# Altium schematic sheet LiPo_4S_balancer.SchDoc
size A4
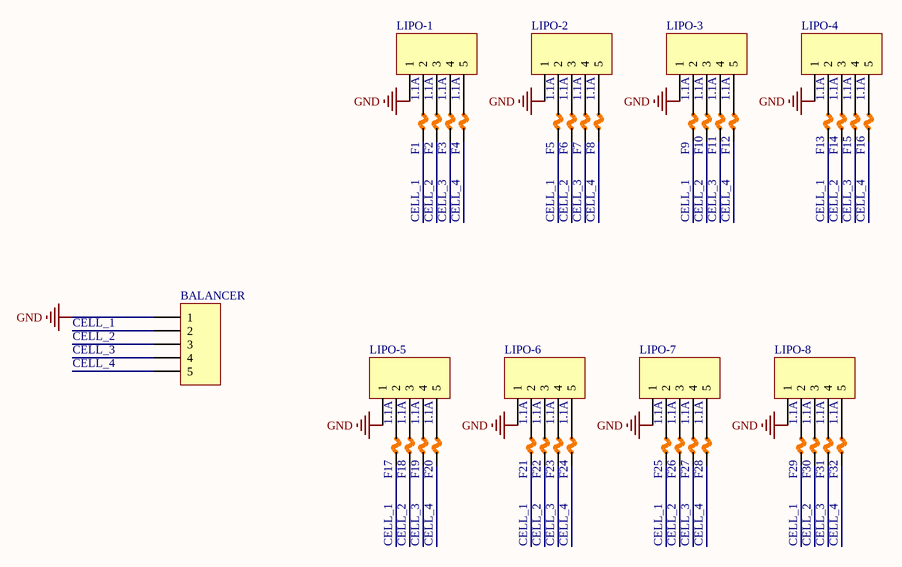
[diagram p0: LiPo_4S_balancer.SchDoc]

## Parts
BALANCER  Header 1X5  [HEADER_2.54MM_F_1x5]  (value not drawn)
F1  1.1A  [TH multifuse 5mm]
F2  1.1A  [TH multifuse 5mm]
F3  1.1A  [TH multifuse 5mm]
F4  1.1A  [TH multifuse 5mm]
F5  1.1A  [TH multifuse 5mm]
F6  1.1A  [TH multifuse 5mm]
F7  1.1A  [TH multifuse 5mm]
F8  1.1A  [TH multifuse 5mm]
F9  1.1A  [TH multifuse 5mm]
F10  1.1A  [TH multifuse 5mm]
F11  1.1A  [TH multifuse 5mm]
F12  1.1A  [TH multifuse 5mm]
F13  1.1A  [TH multifuse 5mm]
F14  1.1A  [TH multifuse 5mm]
F15  1.1A  [TH multifuse 5mm]
F16  1.1A  [TH multifuse 5mm]
F17  1.1A  [TH multifuse 5mm]
F18  1.1A  [TH multifuse 5mm]
F19  1.1A  [TH multifuse 5mm]
F20  1.1A  [TH multifuse 5mm]
F21  1.1A  [TH multifuse 5mm]
F22  1.1A  [TH multifuse 5mm]
F23  1.1A  [TH multifuse 5mm]
F24  1.1A  [TH multifuse 5mm]
F25  1.1A  [TH multifuse 5mm]
F26  1.1A  [TH multifuse 5mm]
F27  1.1A  [TH multifuse 5mm]
F28  1.1A  [TH multifuse 5mm]
F29  1.1A  [TH multifuse 5mm]
F30  1.1A  [TH multifuse 5mm]
F31  1.1A  [TH multifuse 5mm]
F32  1.1A  [TH multifuse 5mm]
LIPO-1  Header 1X5  [HEADER_2.54MM_F_1x5]  (value not drawn)
LIPO-2  Header 1X5  [HEADER_2.54MM_F_1x5]  (value not drawn)
LIPO-3  Header 1X5  [HEADER_2.54MM_F_1x5]  (value not drawn)
LIPO-4  Header 1X5  [HEADER_2.54MM_F_1x5]  (value not drawn)
LIPO-5  Header 1X5  [HEADER_2.54MM_F_1x5]  (value not drawn)
LIPO-6  Header 1X5  [HEADER_2.54MM_F_1x5]  (value not drawn)
LIPO-7  Header 1X5  [HEADER_2.54MM_F_1x5]  (value not drawn)
LIPO-8  Header 1X5  [HEADER_2.54MM_F_1x5]  (value not drawn)

## Nets
GND: BALANCER.1 LIPO-1.1 LIPO-2.1 LIPO-3.1 LIPO-4.1 LIPO-5.1 LIPO-6.1 LIPO-7.1 LIPO-8.1
CELL_1: BALANCER.2 F1.1 F5.1 F9.1 F13.1 F17.1 F21.1 F25.1 F29.1
CELL_2: BALANCER.3 F2.1 F6.1 F10.1 F14.1 F18.1 F22.1 F26.1 F30.1
CELL_3: BALANCER.4 F3.1 F7.1 F11.1 F15.1 F19.1 F23.1 F27.1 F31.1
CELL_4: BALANCER.5 F4.1 F8.1 F12.1 F16.1 F20.1 F24.1 F28.1 F32.1
NetF1_2: F1.2 LIPO-1.2
NetF2_2: F2.2 LIPO-1.3
NetF3_2: F3.2 LIPO-1.4
NetF4_2: F4.2 LIPO-1.5
NetF5_2: F5.2 LIPO-2.2
NetF6_2: F6.2 LIPO-2.3
NetF7_2: F7.2 LIPO-2.4
NetF8_2: F8.2 LIPO-2.5
NetF9_2: F9.2 LIPO-3.2
NetF10_2: F10.2 LIPO-3.3
NetF11_2: F11.2 LIPO-3.4
NetF12_2: F12.2 LIPO-3.5
NetF13_2: F13.2 LIPO-4.2
NetF14_2: F14.2 LIPO-4.3
NetF15_2: F15.2 LIPO-4.4
NetF16_2: F16.2 LIPO-4.5
NetF17_2: F17.2 LIPO-5.2
NetF18_2: F18.2 LIPO-5.3
NetF19_2: F19.2 LIPO-5.4
NetF20_2: F20.2 LIPO-5.5
NetF21_2: F21.2 LIPO-6.2
NetF22_2: F22.2 LIPO-6.3
NetF23_2: F23.2 LIPO-6.4
NetF24_2: F24.2 LIPO-6.5
NetF25_2: F25.2 LIPO-7.2
NetF26_2: F26.2 LIPO-7.3
NetF27_2: F27.2 LIPO-7.4
NetF28_2: F28.2 LIPO-7.5
NetF29_2: F29.2 LIPO-8.2
NetF30_2: F30.2 LIPO-8.3
NetF31_2: F31.2 LIPO-8.4
NetF32_2: F32.2 LIPO-8.5

## Library data of the parts
BALANCER LIPO-1-LIPO-8 = Header 1X5: Header, 5-Pin; LatestRevisionDate: 17-Jul-2002; LatestRevisionNote: Re-released for DXP Platform.; Publisher: Altium Limited
F1-F32 = MULTIFUSE: Order Info: TODO; Part Number: TODO; Value: 1.1A